# Altium schematic sheet M2_KEY_M.SchDoc
size A4
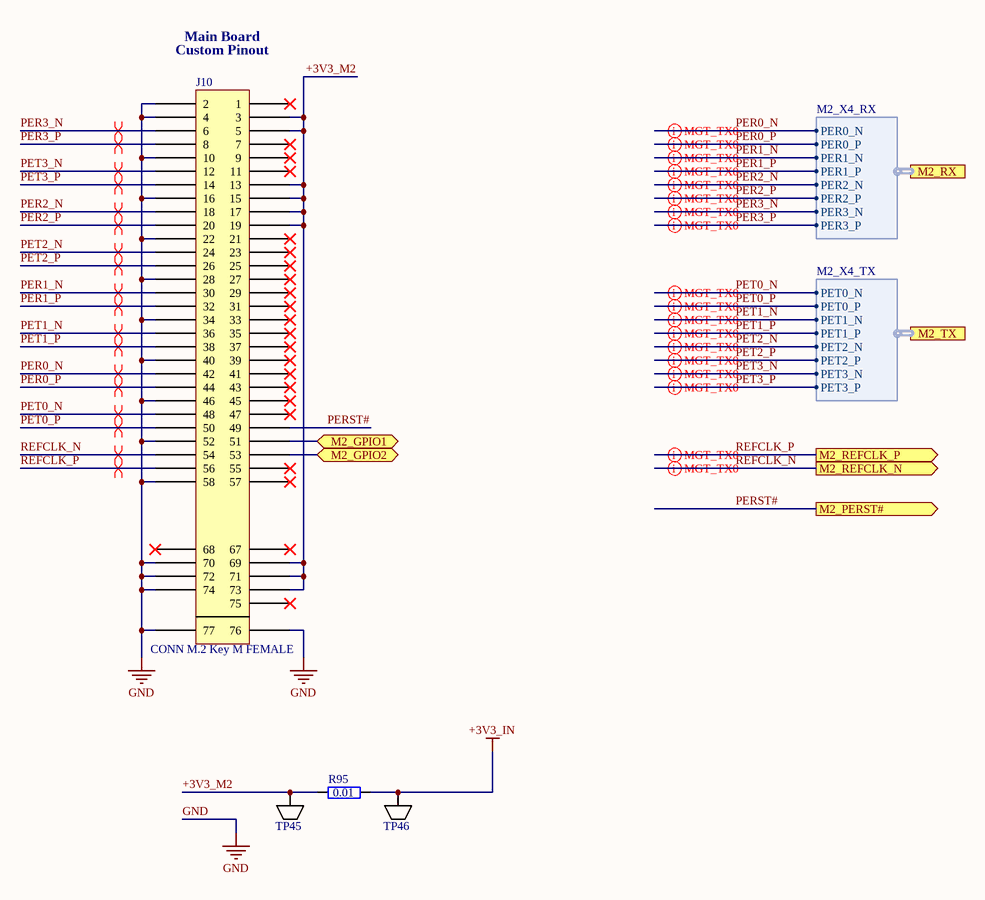
[diagram p0: M2_KEY_M.SchDoc]

## Parts
J10  CONN M.2 Key M FEMALE  [TE_M2_KEYM_2199230]
R95  0.01  [GEN_R_0603]
TP45  5015  [KEY_5015]  (value not drawn)
TP46  5015  [KEY_5015]  (value not drawn)

## Ports
M2_GPIO1 (bidir), M2_GPIO2 (bidir), M2_PERST# (out), M2_REFCLK_N (out), M2_REFCLK_P (out), M2_RX (harness M2_X4_RX), M2_TX (harness M2_X4_TX)

## Harnesses
M2_X4_RX: PER0_N, PER0_P, PER1_N, PER1_P, PER2_N, PER2_P, PER3_N, PER3_P
M2_X4_TX: PET0_N, PET0_P, PET1_N, PET1_P, PET2_N, PET2_P, PET3_N, PET3_P

## Nets
+3V3_IN: R95.2 TP46.1
GND: J10.2 J10.4 J10.10 J10.16 J10.22 J10.28 J10.34 J10.40 J10.46 J10.52 J10.58 J10.70 J10.72 J10.74 J10.76 J10.77
+3V3_M2: J10.3 J10.5 J10.13 J10.15 J10.17 J10.19 J10.69 J10.71 J10.73 R95.1 TP45.1
M2_GPIO1: J10.51 ; port M2_GPIO1
M2_GPIO2: J10.53 ; port M2_GPIO2
PER0_N: J10.42 ; port M2_RX.PER0_N
PER0_P: J10.44 ; port M2_RX.PER0_P
PER1_N: J10.30 ; port M2_RX.PER1_N
PER1_P: J10.32 ; port M2_RX.PER1_P
PER2_N: J10.18 ; port M2_RX.PER2_N
PER2_P: J10.20 ; port M2_RX.PER2_P
PER3_N: J10.6 ; port M2_RX.PER3_N
PER3_P: J10.8 ; port M2_RX.PER3_P
PERST#: J10.49 ; port M2_PERST#
PET0_N: J10.48 ; port M2_TX.PET0_N
PET0_P: J10.50 ; port M2_TX.PET0_P
PET1_N: J10.36 ; port M2_TX.PET1_N
PET1_P: J10.38 ; port M2_TX.PET1_P
PET2_N: J10.24 ; port M2_TX.PET2_N
PET2_P: J10.26 ; port M2_TX.PET2_P
PET3_N: J10.12 ; port M2_TX.PET3_N
PET3_P: J10.14 ; port M2_TX.PET3_P
REFCLK_N: J10.54 ; port M2_REFCLK_N
REFCLK_P: J10.56 ; port M2_REFCLK_P

Not connected (* = marked no-connect by the designer): J10 1* 7* 9* 11* 21* 23* 25* 27* 29* 31* 33* 35* 37* 39* 41* 43* 45* 47* 55* 57* 67* 68* 75*

## Layout directives
differential pair; differential pair class PCIe: PER0_N, PER0_P, PER1_N, PER1_P, PER2_N, PER2_P, PER3_N, PER3_P, PET0_N, PET0_P, PET1_N, PET1_P, PET2_N, PET2_P, PET3_N, PET3_P, REFCLK_N, REFCLK_P

## Notes on the sheet
- Main Board
- (near J10) Custom Pinout

## Library data of the parts
R95 = RES 0.01 OHM 1% 1/4W 0603: Tolerance: 1%; Power Rating: 0.25W; Supplier 1: Digi-Key; Supplier Part Number 1: 408-1404-1-ND; Value: 0.01; Package: 0603
TP45 TP46 = TP KEYSTONE 5015: Supplier 1: Digi-Key; Supplier Part Number 1: 36-5015CT-ND
J10 = CONN M.2 Key M FEMALE: Supplier 1: Digi-Key; Supplier Part Number 1: A124992CT-ND